# EAGLE design Robot (EAGLE 9.1.0)
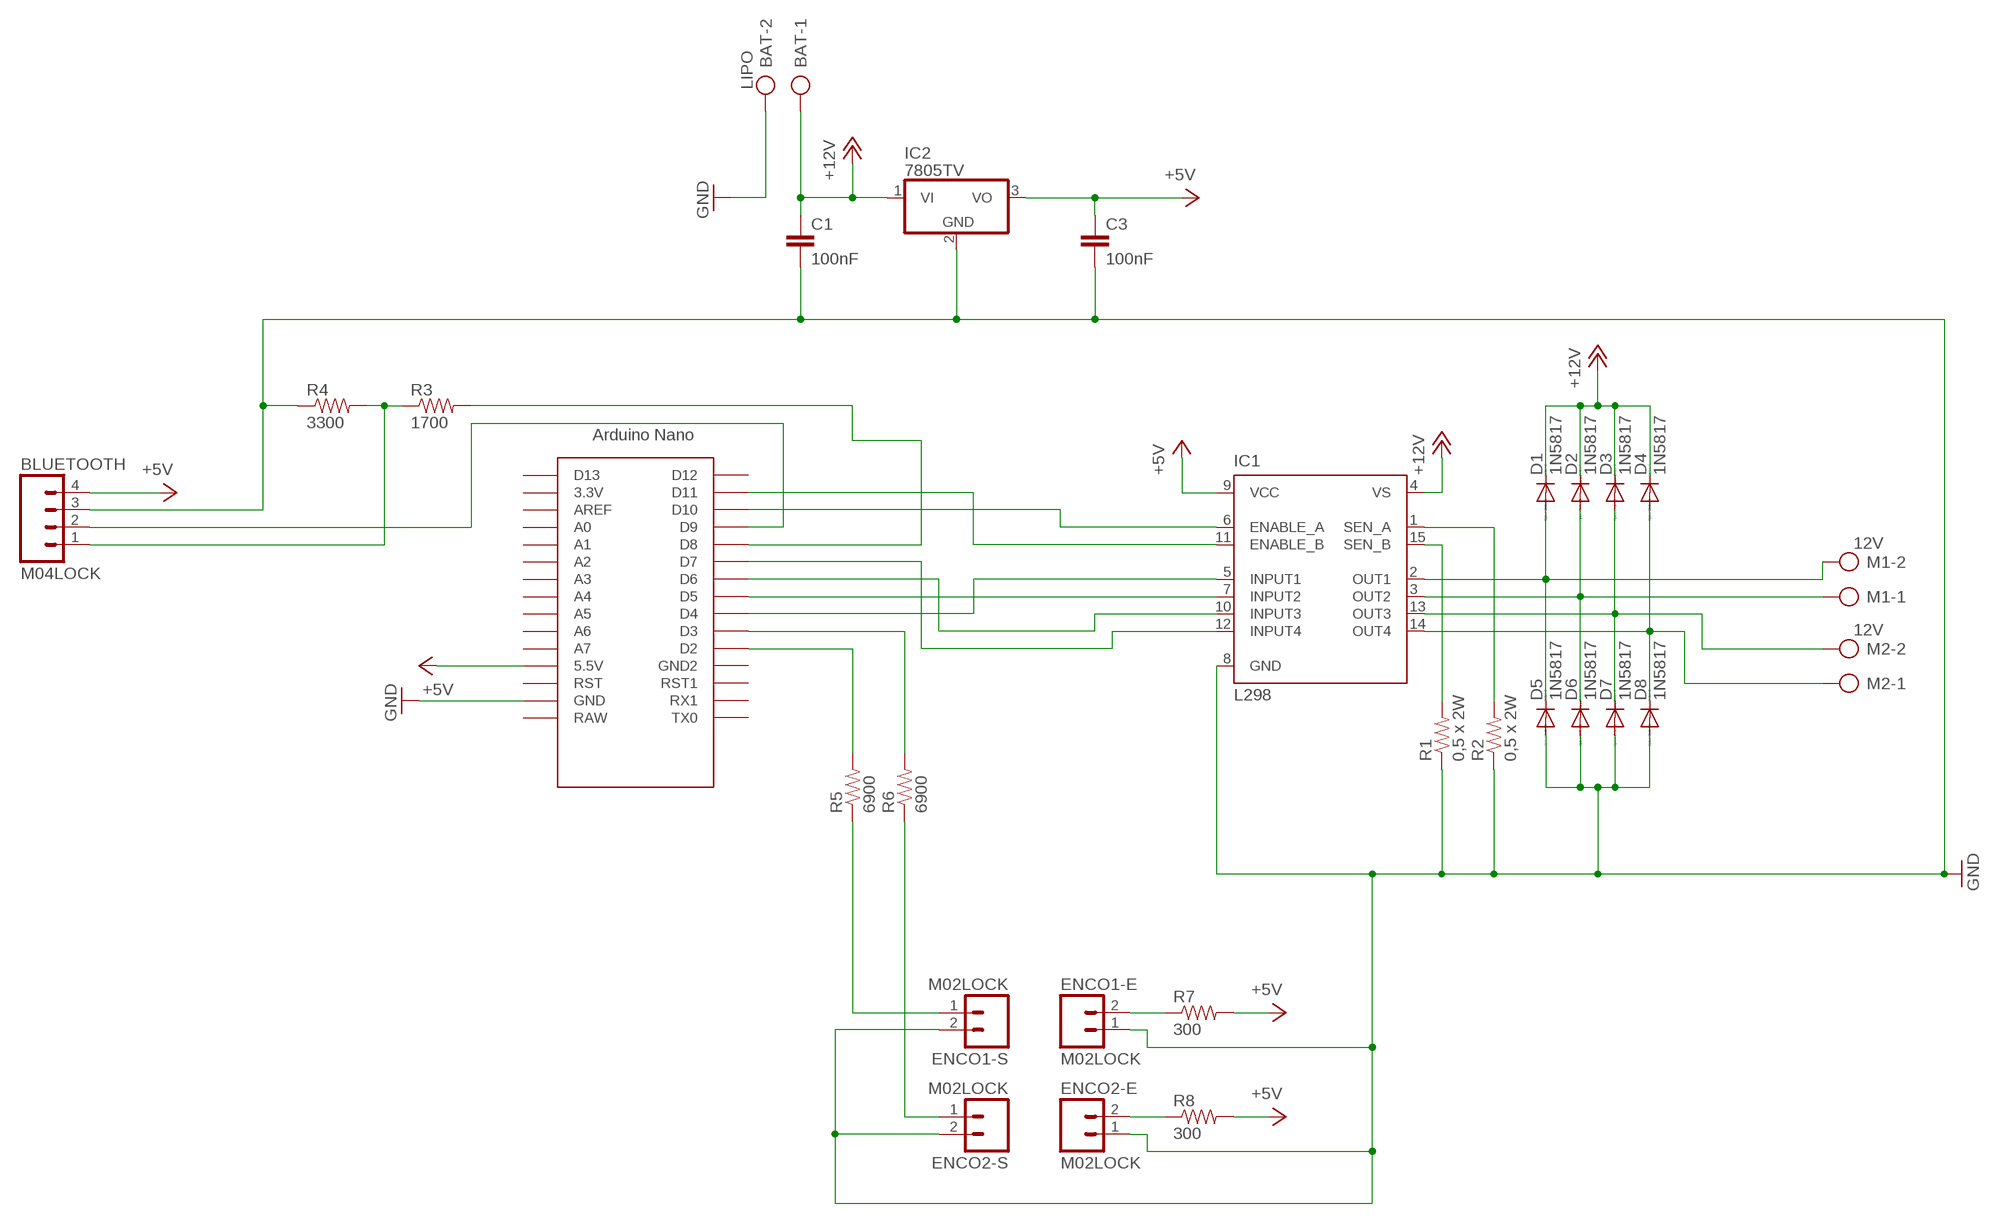
[diagram p0: schematic, sheet 1]

## Parts
BAT  LIPO  AK500/2-H  [AK500/2-H]
BLUETOOTH  M04LOCK  [1X04_LOCK]
C1  100nF  C-EU050-025X075  [C050-025X075]
C3  100nF  C-EU050-025X075  [C050-025X075]
D1  1N5817  1N4004  [DO41-10]
D2  1N5817  1N4004  [DO41-10]
D3  1N5817  1N4004  [DO41-10]
D4  1N5817  1N4004  [DO41-10]
D5  1N5817  1N4004  [DO41-10]
D6  1N5817  1N4004  [DO41-10]
D7  1N5817  1N4004  [DO41-10]
D8  1N5817  1N4004  [DO41-10]
ENCO1-E  M02LOCK  [1X02_LOCK]
ENCO1-S  M02LOCK  [1X02_LOCK]
ENCO2-E  M02LOCK  [1X02_LOCK]
ENCO2-S  M02LOCK  [1X02_LOCK]
IC1  L298  [MULTIWATT-15]
IC2  7805TV  [TO220V]
M1  12V  AK500/2-H  [AK500/2-H]
M2  12V  AK500/2-H  [AK500/2-H]
R1  0,5 x 2W  RESISTORPTH-1/2W  [AXIAL-0.5]
R2  0,5 x 2W  RESISTORPTH-1/2W  [AXIAL-0.5]
R3  1700  RESISTORAXIAL-0.3  [AXIAL-0.3]
R4  3300  RESISTORAXIAL-0.3  [AXIAL-0.3]
R5  6900  RESISTORAXIAL-0.3  [AXIAL-0.3]
R6  6900  RESISTORAXIAL-0.3  [AXIAL-0.3]
R7  300  RESISTORAXIAL-0.3  [AXIAL-0.3]
R8  300  RESISTORAXIAL-0.3  [AXIAL-0.3]
U$1  NANO  [NANO]

## Nets
+5V: BLUETOOTH.4 C3.1 IC1.9(VCC) IC2.3(VO) R7.P$2 R8.P$2 U$1.5V(5.5V)
+12V [12V]: BAT.1 C1.1 D1.C D2.C D3.C D4.C IC1.4(VS) IC2.1(VI)
GND [12V]: BAT.2 BLUETOOTH.3 C1.2 C3.2 D5.A D6.A D7.A D8.A ENCO1-E.1 ENCO1-S.2 ENCO2-E.1 ENCO2-S.2 IC1.8(GND) IC2.2(GND) R1.P$1 R2.P$1 R4.P$1 U$1.GND
N$1 [12V]: D1.A D5.C IC1.2(OUT1) M1.2
N$2 [12V]: D3.A D7.C IC1.13(OUT3) M2.2
N$3: IC1.7(INPUT2) U$1.D5
N$4 [12V]: D4.A D8.C IC1.14(OUT4) M2.1
N$6: R3.P$2 U$1.D8
N$7 [12V]: D2.A D6.C IC1.3(OUT2) M1.1
N$8: IC1.5(INPUT1) U$1.D4
N$9: IC1.1(SEN_A) R2.P$2
N$10: IC1.15(SEN_B) R1.P$2
N$11: IC1.6(ENABLE_A) U$1.D10
N$12: BLUETOOTH.1 R3.P$1 R4.P$2
N$13: R5.P$2 U$1.D2
N$14: IC1.11(ENABLE_B) U$1.D11
N$15: IC1.10(INPUT3) U$1.D6
N$17: IC1.12(INPUT4) U$1.D7
N$18: BLUETOOTH.2 U$1.D9
N$20: R6.P$2 U$1.D3
N$21: ENCO1-S.1 R5.P$1
N$22: ENCO2-S.1 R6.P$1
N$23: ENCO1-E.2 R7.P$1
N$24: ENCO2-E.2 R8.P$1
Unconnected: U$1.3.3V U$1.A0 U$1.A1 U$1.A2 U$1.A3 U$1.A4 U$1.A5 U$1.A6 U$1.A7 U$1.AREF U$1.D12 U$1.D13 U$1.GND1(GND2) U$1.ICSP1 U$1.ICSP2 U$1.ICSP3 U$1.ICSP4 U$1.ICSP5 U$1.ICSP6 U$1.RAW U$1.RST U$1.RST1 U$1.RX1 U$1.TX0

## Library data of the parts
BAT M1 M2 = con-ptr500:AK500/2-H: CONNECTOR Aug. 2004 / PTR Meßtechnik: Die Bezeichnung der Serie AK505 wurde geändert. Es handelt sich hierbei um AK500 in horizontaler Ausführung.; OC_FARNELL: unknown; OC_NEWARK: unknown
BLUETOOTH = SparkFun-Connectors:M04: Header 4 Standard 4-pin 0.1" header. Use with straight break away headers (SKU : PRT-00116), right angle break away headers (PRT-00553), swiss pins (PRT-00743), machine pins (PRT-00117), and female headers (PRT-00115). Molex polarized connector foot print use with SKU : PRT-08231 with associated crimp pins and housings. 1MM SMD Version SKU: PRT-10208; PROD_ID: CONN-09696
C1 C3 = resistor:C-EU: CAPACITOR, European symbol
D1-D8 = diode:1N4004: DIODE general purpose rectifier, 1 A
ENCO1-E ENCO1-S ENCO2-E ENCO2-S = SparkFun-Connectors:M02: Standard 2-pin 0.1" header. Use with - straight break away headers ( PRT-00116) - right angle break away headers (PRT-00553) - swiss pins (PRT-00743) - machine pins (PRT-00117) - female headers (PRT-00115) Molex polarized connector foot print use with: PRT-08233 with associated crimp pins and housings. 2.54_SCREWTERM for use with PRT-10571. 3.5mm Screw Terminal footprints for PRT-08084 5mm Screw Terminal footprints for use with PRT-08432
IC1 = st-microelectronics:L298: DUAL FULL-BRIDGE DRIVER; MPN: L298N; OC_FARNELL: 1589425; OC_NEWARK: 32M1527
IC2 = linear:78*: Positive VOLTAGE REGULATOR Source: http://cache.national.com/ds/LM/LM78L05.pdf http://www.fairchildsemi.com/ds/LM/LM7805.pdf
R1-R8 = SparkFun-Resistors:RESISTOR: Resistor Basic schematic elements and footprints for 0603, 1206, and PTH resistors.
U$1 = Arduino-clone:NANO: Arduino Nano

## Net classes
0 Signal: width 0.254 mm
1 12V: width 0.508 mm

## Board
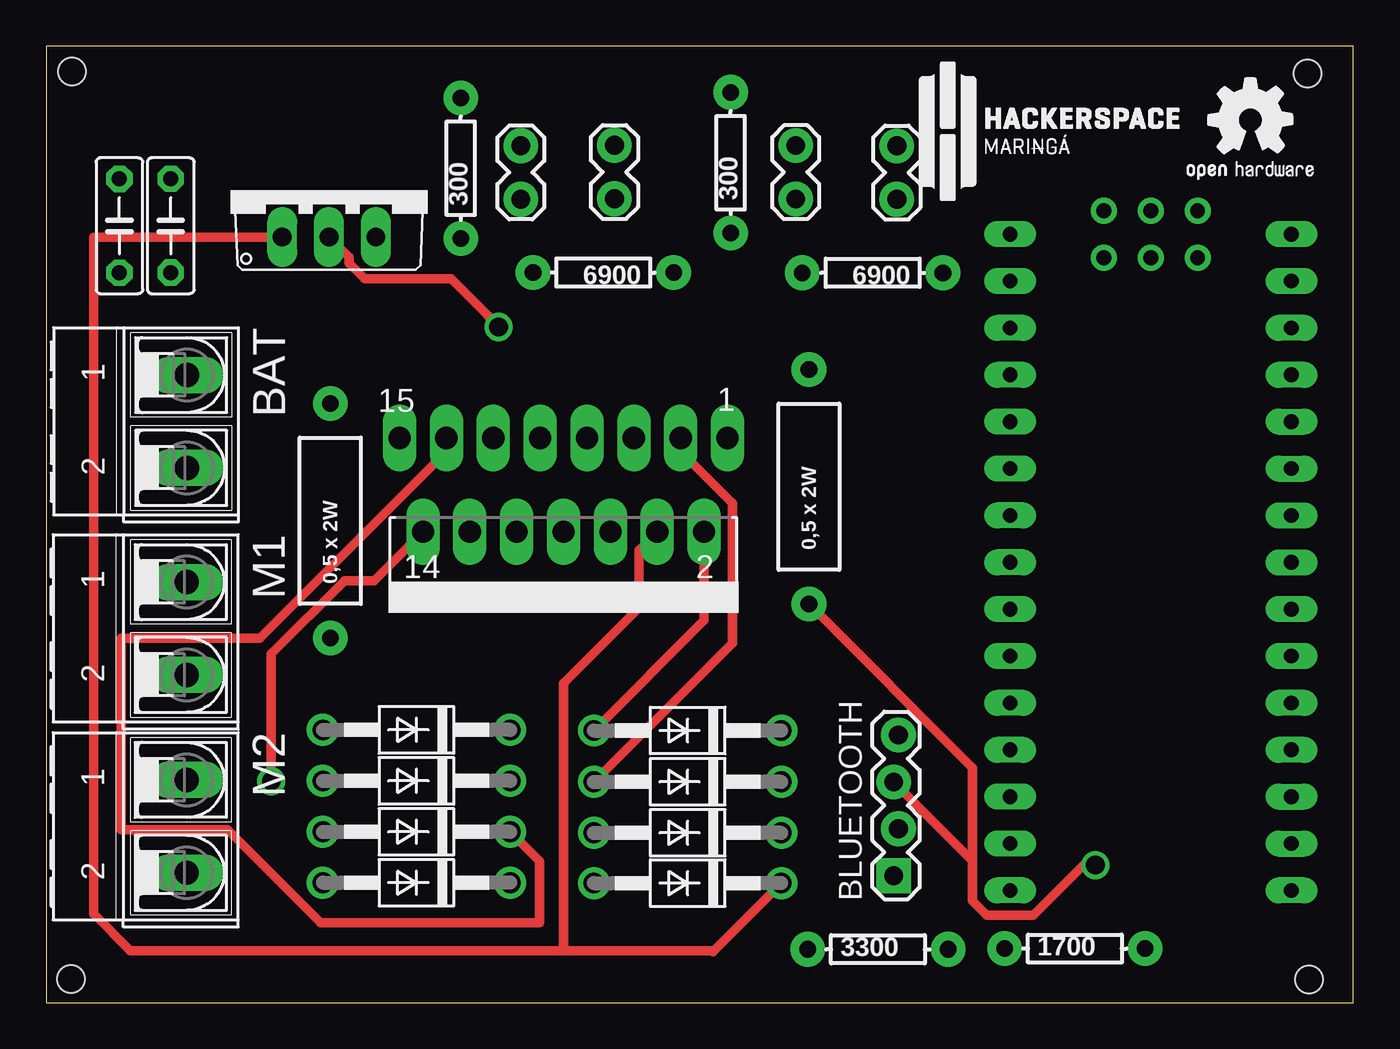
[diagram p1: board, top side]
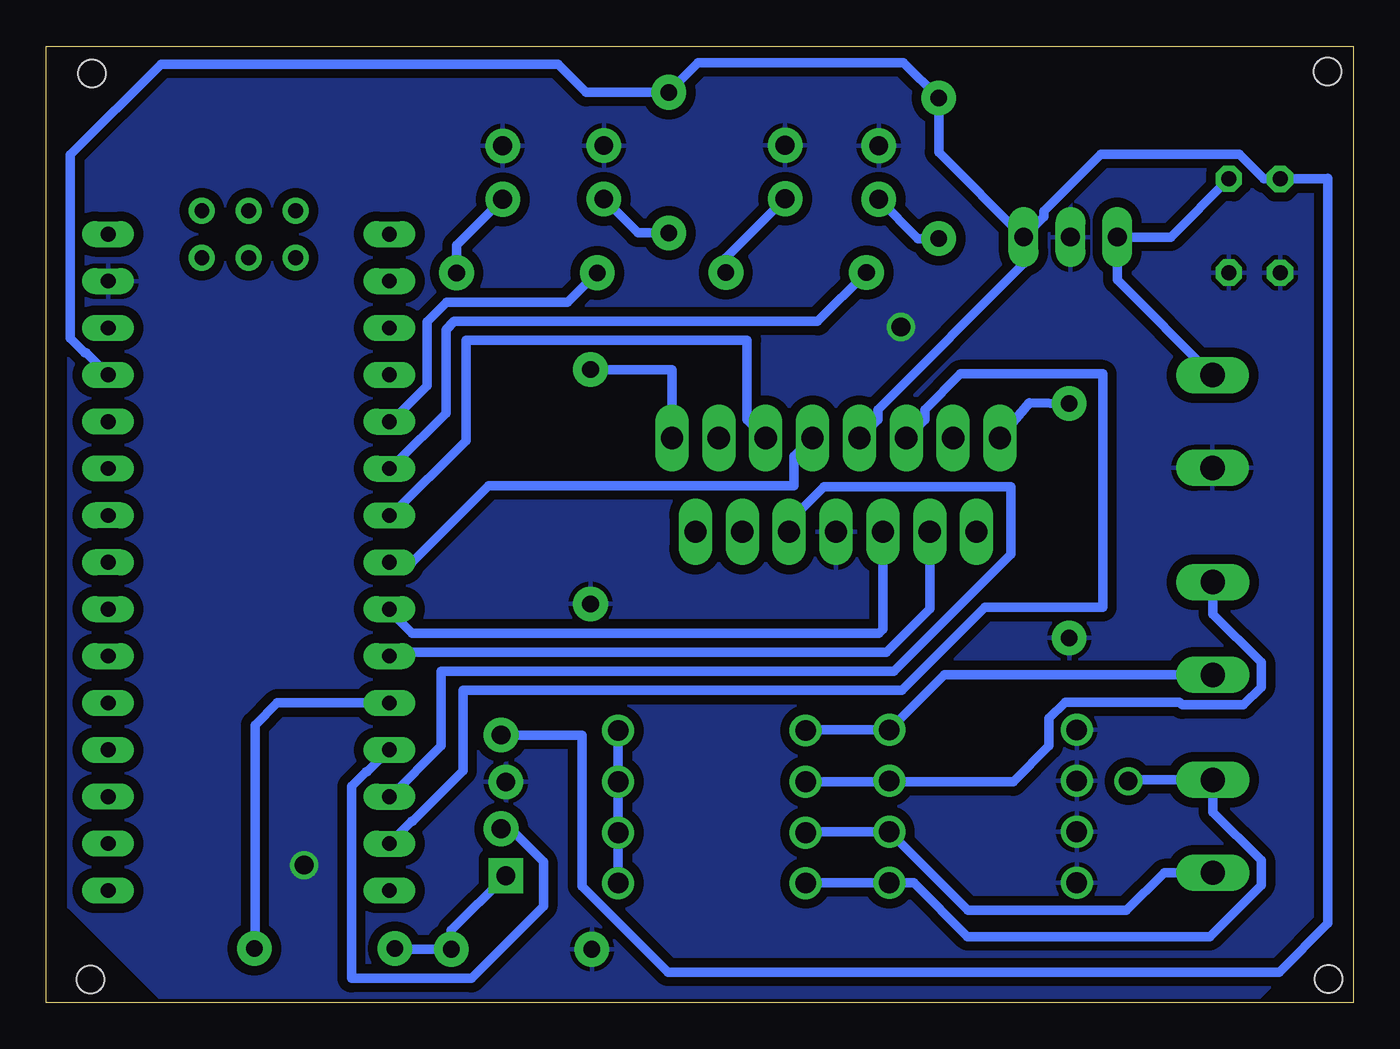
[diagram p2: board, bottom side, seen from below]

Size 70.86 x 51.82 mm. Coordinates in mm from the lower left corner, seen from the top.
Outline: 0.02,0 70.86,0 70.84,51.82 0,51.82 0.02,0
Copper layers (1*16): Top 0.035mm / dielectric 1.5mm / Bottom 0.035mm
Design rules "SparkFun *": minimum track width 8mil, minimum drill 20mil, track to track 20mil, track to pad 15mil, pad to pad 8mil, via to via 8mil, smd to smd 8mil, copper to edge 8mil, drill to drill 8mil, minimum pad ring 12mil, minimum via ring 10mil, stop-mask expansion 4mil, vias tented up to drill 20mil, thermal gap 10mil
Holes 1.5 mm at 68.46,1.26 1.35,1.27 1.39,50.45 68.38,50.34

### Footprints (pad centres in the part's own frame; a part is rotated, then mirrored left to right if it is on the bottom)
AK500/2-H = drill 1.321 long: 1 -2.515,0; 2 2.515,0
1X04_LOCK = drill 1.016 pad 1.88 square: 1 0,0.127 | drill 1.016 pad 1.88: 2 2.54,-0.127; 3 5.08,0.127; 4 7.62,-0.127
C050-025X075 = drill 0.813 octagon: 1 -2.54,0; 2 2.54,0
DO41-10 = drill 1.118: A 5.08,0; C -5.08,0
1X02_LOCK = drill 1.016 pad 1.88: 1 -0.178,0; 2 2.718,0
MULTIWATT-15 = drill 1.2 long: 1 -8.89,-7.62; 2 -7.62,-2.54; 3 -6.35,-7.62; 4 -5.08,-2.54; 5 -3.81,-7.62; 6 -2.54,-2.54; 7 -1.27,-7.62; 8 0,-2.54; 9 1.27,-7.62; 10 2.54,-2.54; 11 3.81,-7.62; 12 5.08,-2.54; 13 6.35,-7.62; 14 7.62,-2.54; 15 8.89,-7.62
TO220V = drill 1.016 long: 1 -2.54,-2.54; 2 0,-2.54; 3 2.54,-2.54
AXIAL-0.5 = drill 0.9 pad 1.88: P$1 -6.35,0; P$2 6.35,0
AXIAL-0.3 = drill 0.9 pad 1.88: P$1 -3.81,0; P$2 3.81,0
NANO = drill 0.8 long: 3.3V -10.16,24.13; 5V -10.16,-1.27; A0 -10.16,19.05; A1 -10.16,16.51; A2 -10.16,13.97; A3 -10.16,11.43; A4 -10.16,8.89; A5 -10.16,6.35; A6 -10.16,3.81; A7 -10.16,1.27; AREF -10.16,21.59; D2 5.08,1.27; D3 5.08,3.81; D4 5.08,6.35; D5 5.08,8.89; D6 5.08,11.43; D7 5.08,13.97; D8 5.08,16.51; D9 5.08,19.05; D10 5.08,21.59; D11 5.08,24.13; D12 5.08,26.67; D13 -10.16,26.67; GND -10.16,-6.35; GND1 5.08,-1.27; RAW -10.16,-8.89; RST -10.16,-3.81; RST1 5.08,-3.81; RX1 5.08,-6.35; TX0 5.08,-8.89 | drill 0.8: ICSP1 -5.08,-10.16; ICSP2 -5.08,-7.62; ICSP3 -2.54,-10.16; ICSP4 -2.54,-7.62; ICSP5 0,-10.16; ICSP6 0,-7.62

### Placement (x,y rotation side)
BAT  7.64,31.49 270 top
BLUETOOTH  46.07,6.87 90 top
C1  6.75,42.09 270 top
C3  3.98,42.09 270 top
D1  34.78,14.74 180 top
D2  34.78,11.96 180 top
D3  34.78,9.2 180 top
D4  34.78,6.47 180 top
D5  20.08,14.78 180 top
D6  20.08,12.01 180 top
D7  20.08,9.25 180 top
D8  20.08,6.49 180 top
ENCO1-E  40.63,46.26 270 top
ENCO1-S  46.11,43.7 90 top
ENCO2-E  25.73,46.25 270 top
ENCO2-S  30.81,43.73 90 top
IC1  28.05,22.97 180 top
IC2  15.34,44.02 0 top
M1  7.62,20.27 270 top
M2  7.62,9.55 270 top
R1  15.4,26.1 90 top
R2  41.35,27.95 90 top
R3  55.76,2.92 0 top
R4  45.09,2.88 0 top
R5  44.8,39.54 180 top
R6  30.2,39.56 180 top
R7  37.1,45.51 90 top
R8  22.48,45.21 90 top
U$1  57.34,32.74 180 top
U$2  [OSHW2]  61.46,43.54 0 top

### Tracks (layer width: path | path; a pad name or v marks a point on that pad's centre or on a via)
+5V
  Bottom 0.508: IC2.3 16.78,42.57 16.78,42.89 13.7,45.98 6.2,45.98 4.85,44.63 C3.1 1.43,44.63 1.4,44.66 1.4,4.28 4.03,1.65 37.16,1.65 41.82,6.31 41.82,14.49 BLUETOOTH.4 | IC2.3 22.48,46.08 R8.P$2 24.38,50.92 35.53,50.92 37.11,49.35 R7.P$2 41.59,49.32 43.12,50.85 64.63,50.85 69.55,45.93 69.55,36 68.76,35.21 68.7,35.21 U$1.5V | IC2.3 17.88,40.04 25.78,32.13 25.78,31.59 IC1.9
+12V
  Top 0.508: IC2.1 2.57,41.48 2.57,4.8 4.56,2.81 28.05,2.81 | D4.C 36.14,2.75 36.09,2.81 28.05,2.81 | 28.05,2.81 28.05,17.31 32.13,21.39 32.13,24.51 IC1.4
  Bottom 0.508: D1.C D2.C D3.C D4.C | D4.C | BAT.1 12.8,39.16 IC2.1 9.91,41.48 C1.1
GND  (via drill 1.02)
  Top 0.508: BLUETOOTH.3 50.22,7.68 | 50.22,7.68 50.22,5.52 51,4.73 53.52,4.73 56.24,7.45 v56.87,7.45 | R2.P$1 50.22,12.73 50.22,7.68 | IC2.2 16.43,40.39 16.43,40.06 17.28,39.22 21.96,39.22 23.92,37.25 v24.53,36.61
  pour Bottom: 0.03,51.79 0.03,5.31 5.33,0.02 64.5,0.02 69.64,5.15 69.64,46.67 64.52,51.79
N$1
  Top 0.508: D1.A 35.67,20.71 IC1.2
  Bottom 0.508: D1.A 29.66,14.78 D5.C 22.18,17.75 M1.2
N$2
  Top 0.508: IC1.13 21.7,29.86 11.59,19.75 4.08,19.75 4.08,9.35 9.84,9.35 14.87,4.32 26.75,4.32 26.75,7.66 D7.C
  Bottom 0.508: D3.A 29.64,9.25 D7.C 20.9,4.99 12.3,4.99 10.26,7.03 M2.2
N$3
  Bottom 0.508: IC1.7 30.32,29.59 30.32,28.01 46.88,28.01 51.03,23.85 U$1.D5
N$4  (via drill 1.02)
  Top 0.508: IC1.14 17.77,22.86 16.17,22.86 12.21,18.89 v12.21,12
  Bottom 0.508: D4.A 29.67,6.49 D8.C 23.83,6.49 20.91,3.57 7.79,3.57 5,6.36 5,7.71 7.62,10.32 M2.1 12.15,12.06 v12.21,12
N$6
  Bottom 0.508: R3.P$2 59.53,2.97 59.53,15.03 58.33,16.23 U$1.D8
N$7
  Top 0.508: IC1.3 34.4,29.86 37.21,27.05 37.21,19.47 D2.A
  Bottom 0.508: D6.C 25.21,11.96 | 25.21,11.96 D2.A | 25.21,11.96 18.44,11.96 16.5,13.91 16.5,15.4 15.62,16.27 9.43,16.27 9.28,16.13 5.96,16.13 5,17.08 5,18.43 7.62,21.04 M1.1
N$8
  Bottom 0.508: IC1.5 32.86,31.59 32.86,35.89 48.1,35.89 48.1,30.45 52.15,26.39 U$1.D4
N$9
  Bottom 0.508: IC1.1 36.94,34.3 R2.P$2
N$10
  Bottom 0.508: R1.P$2 17.56,32.5 IC1.15
N$11
  Bottom 0.508: IC1.6 30.59,26.05 28.69,27.96 18.57,27.96 18.57,24.29 24.9,17.96 49.44,17.96 49.44,13.91 52.2,11.15 U$1.D10
N$12
  Bottom 0.508: R3.P$1 51.92,2.89 R4.P$2 48.9,3.92 BLUETOOTH.1
N$13
  Bottom 0.508: R5.P$2 42.59,37.94 49.16,37.94 50.22,36.89 50.22,33.41 52.15,31.47 U$1.D2
N$14
  Bottom 0.508: U$1.D11 51.06,9.81 51,9.81 48.27,12.55 48.27,16.91 24.47,16.91 19.97,21.41 13.58,21.41 13.58,34.07 21.31,34.07 23.24,32.13 23.24,31.59 IC1.11
N$15
  Bottom 0.508: IC1.10 25.51,20.22 25.72,20.01 51.02,20.01 52.26,21.26 U$1.D6
N$17
  Bottom 0.508: IC1.12 22.97,21.33 25.32,18.98 52.01,18.98 52.21,18.77 U$1.D7
N$18
  Bottom 0.508: U$1.D9 53.46,12.49 53.52,12.49 54.31,11.71 54.31,1.31 47.8,1.31 43.9,5.21 43.9,7.62 45.7,9.41 BLUETOOTH.2
N$20
  Bottom 0.508: R6.P$2 29.04,36.91 48.74,36.91 49.18,36.46 49.18,31.94 51.85,29.27 51.92,29.27 U$1.D3
N$21
  Bottom 0.508: ENCO1-S.1 48.61,41.03 R5.P$1
N$22
  Bottom 0.508: ENCO2-S.1 34.01,40.35 R6.P$1
N$23
  Bottom 0.508: ENCO1-E.2 38.79,41.7 R7.P$1
N$24
  Bottom 0.508: ENCO2-E.2 23.6,41.4 R8.P$1